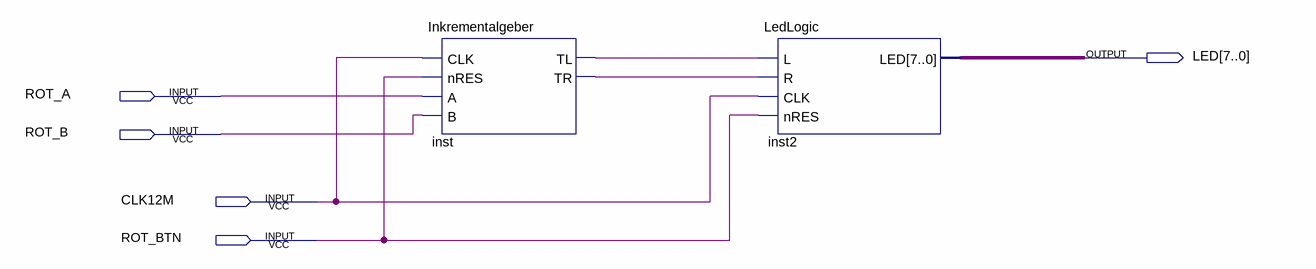
[diagram p0: schematic sheet]
// Quartus schematic RotaryLauflicht.bdf as structural Verilog: 2 symbols, 5 pins
module RotaryLauflicht (
  input  ROT_A,
  input  ROT_B,
  input  CLK12M,
  input  ROT_BTN,
  output [7:0] LED
);

  wire inst_tl, inst_tr;

  Inkrementalgeber inst (.CLK(CLK12M), .nRES(ROT_BTN), .A(ROT_A), .B(ROT_B), .TL(inst_tl), .TR(inst_tr));
  LedLogic inst2 (.L(inst_tl), .R(inst_tr), .CLK(CLK12M), .nRES(ROT_BTN), .LED(LED));
endmodule
